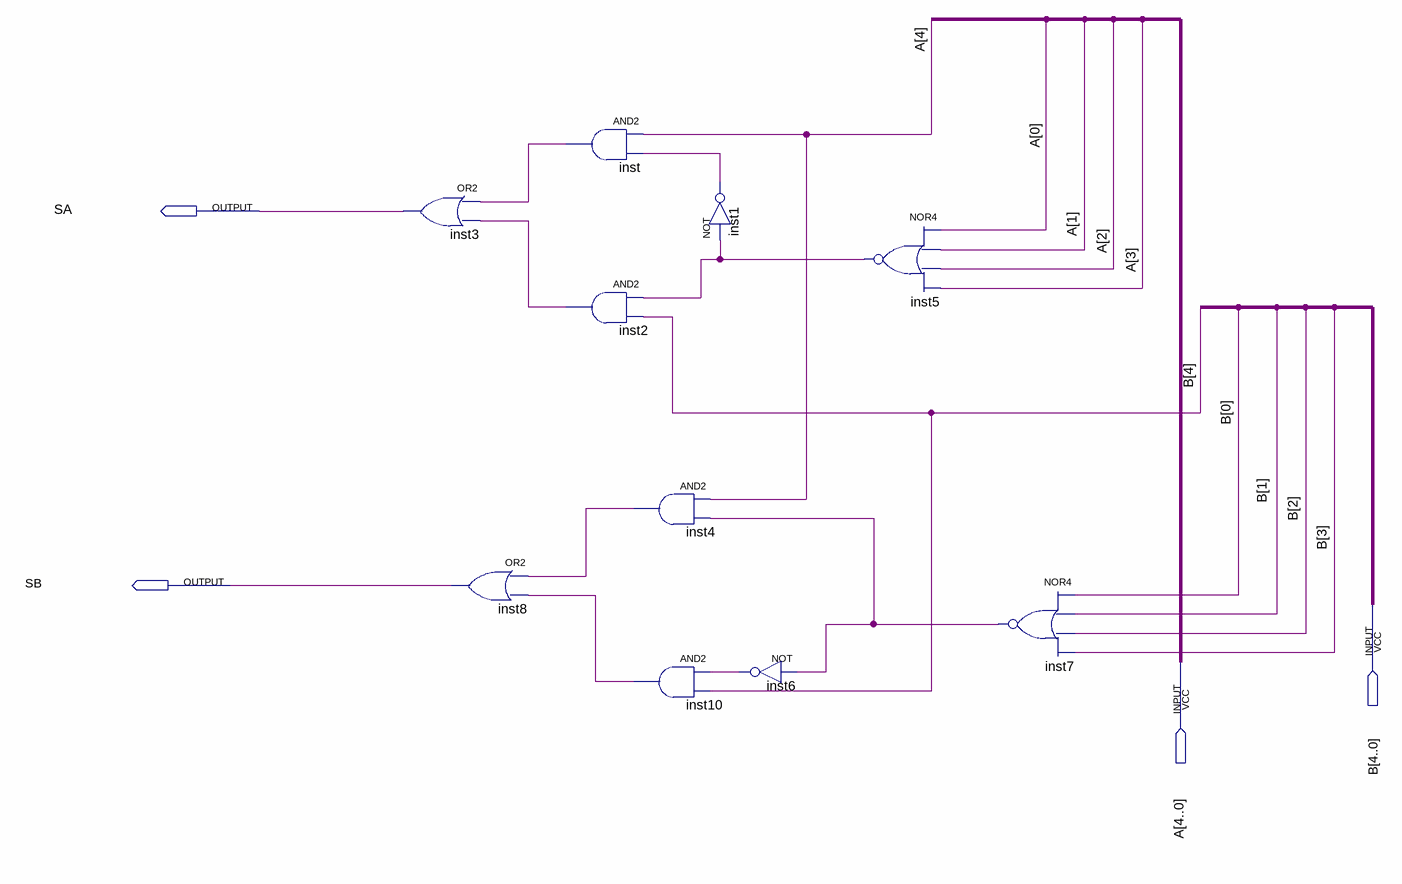
[diagram p0: schematic sheet]
// Quartus schematic caso_zero.bdf as structural Verilog: 10 symbols, 4 pins
module caso_zero (
  input  [4:0] B,
  input  [4:0] A,
  output SA,
  output SB
);

  wire inst1_out, inst2_out, inst4_out, inst5_out, inst6_out, inst7_out, inst10_out, inst_out;

  or inst3 (SA, inst_out, inst2_out);
  or inst8 (SB, inst4_out, inst10_out);
  and inst (inst_out, A[4], inst1_out);
  and inst2 (inst2_out, inst5_out, B[4]);
  and inst4 (inst4_out, A[4], inst7_out);
  and inst10 (inst10_out, inst6_out, B[4]);
  not inst1 (inst1_out, inst5_out);
  not inst6 (inst6_out, inst7_out);
  nor inst5 (inst5_out, A[0], A[1], A[2], A[3]);
  nor inst7 (inst7_out, B[0], B[1], B[2], B[3]);
endmodule
